# Altium schematic sheet EEM_Connectors_JTAG.SchDoc
size 420 x 297 mm; EDA_Number: ARTIQ; CompanyName: WUT ISE; Organization: WUT ISE; DocumentNumber: 5; SheetNumber: 11; Title2: EEM Connectors, JTAG switches; SPICEModelCacheVGBTAUBO: <root> / <DocumentId>VGBTAUBO</DocumentId> / <CacheFrame Number="0"> / <Model Name="pk14" Kind="CKT"> / <Text>*.INC dhvqfn.s / .SUBCKT pk14 / +    1   2   3   4   5   6   7   8   9  10 / +   11  12  13  14 / +   15  16  17  18  19  20  21  22  23  24 / +   25  26  27  28 / * Pin Resistance / r1 1 1001 9.078E-02 / r2 2 1002 8.829E-02 / r3 3 1003 8.731E-02 / r4 4 1004 8.710E-02 / r5 5 1005 8.731E-02 / r6 6 1006 8.829E-02 / r7 7 1007 9.075E-02 / r8 8 1008 9.072E-02 / r9 9 1009 8.809E-02 / r10 10 1010 8.716E-02 / r11 11 1011 8.706E-02 / r12 12 1012 8.720E-02 / r13 13 1013 8.816E-02 / r14 14 1014 9.068E-02 / * Pin Inductance / l1 1001 15 2.981E-09 / l2 1002 16 2.447E-09 / l3 1003 17 2.304E-09 / l4 1004 18 2.291E-09 / l5 1005 19 2.307E-09 / l6 1006 20 2.449E-09 / l7 1007 21 2.971E-09 / l8 1008 22 2.972E-09 / l9 1009 23 2.425E-09 / l10 1010 24 2.286E-09 / l11 1011 25 2.280E-09 / l12 1012 26 2.286E-09 / l13 1013 27 2.425E-09 / l14 1014 28 2.975E-09 / .ENDS pk14</Text> / </Model> / </CacheFrame> / </root>; ModifiedDate: -
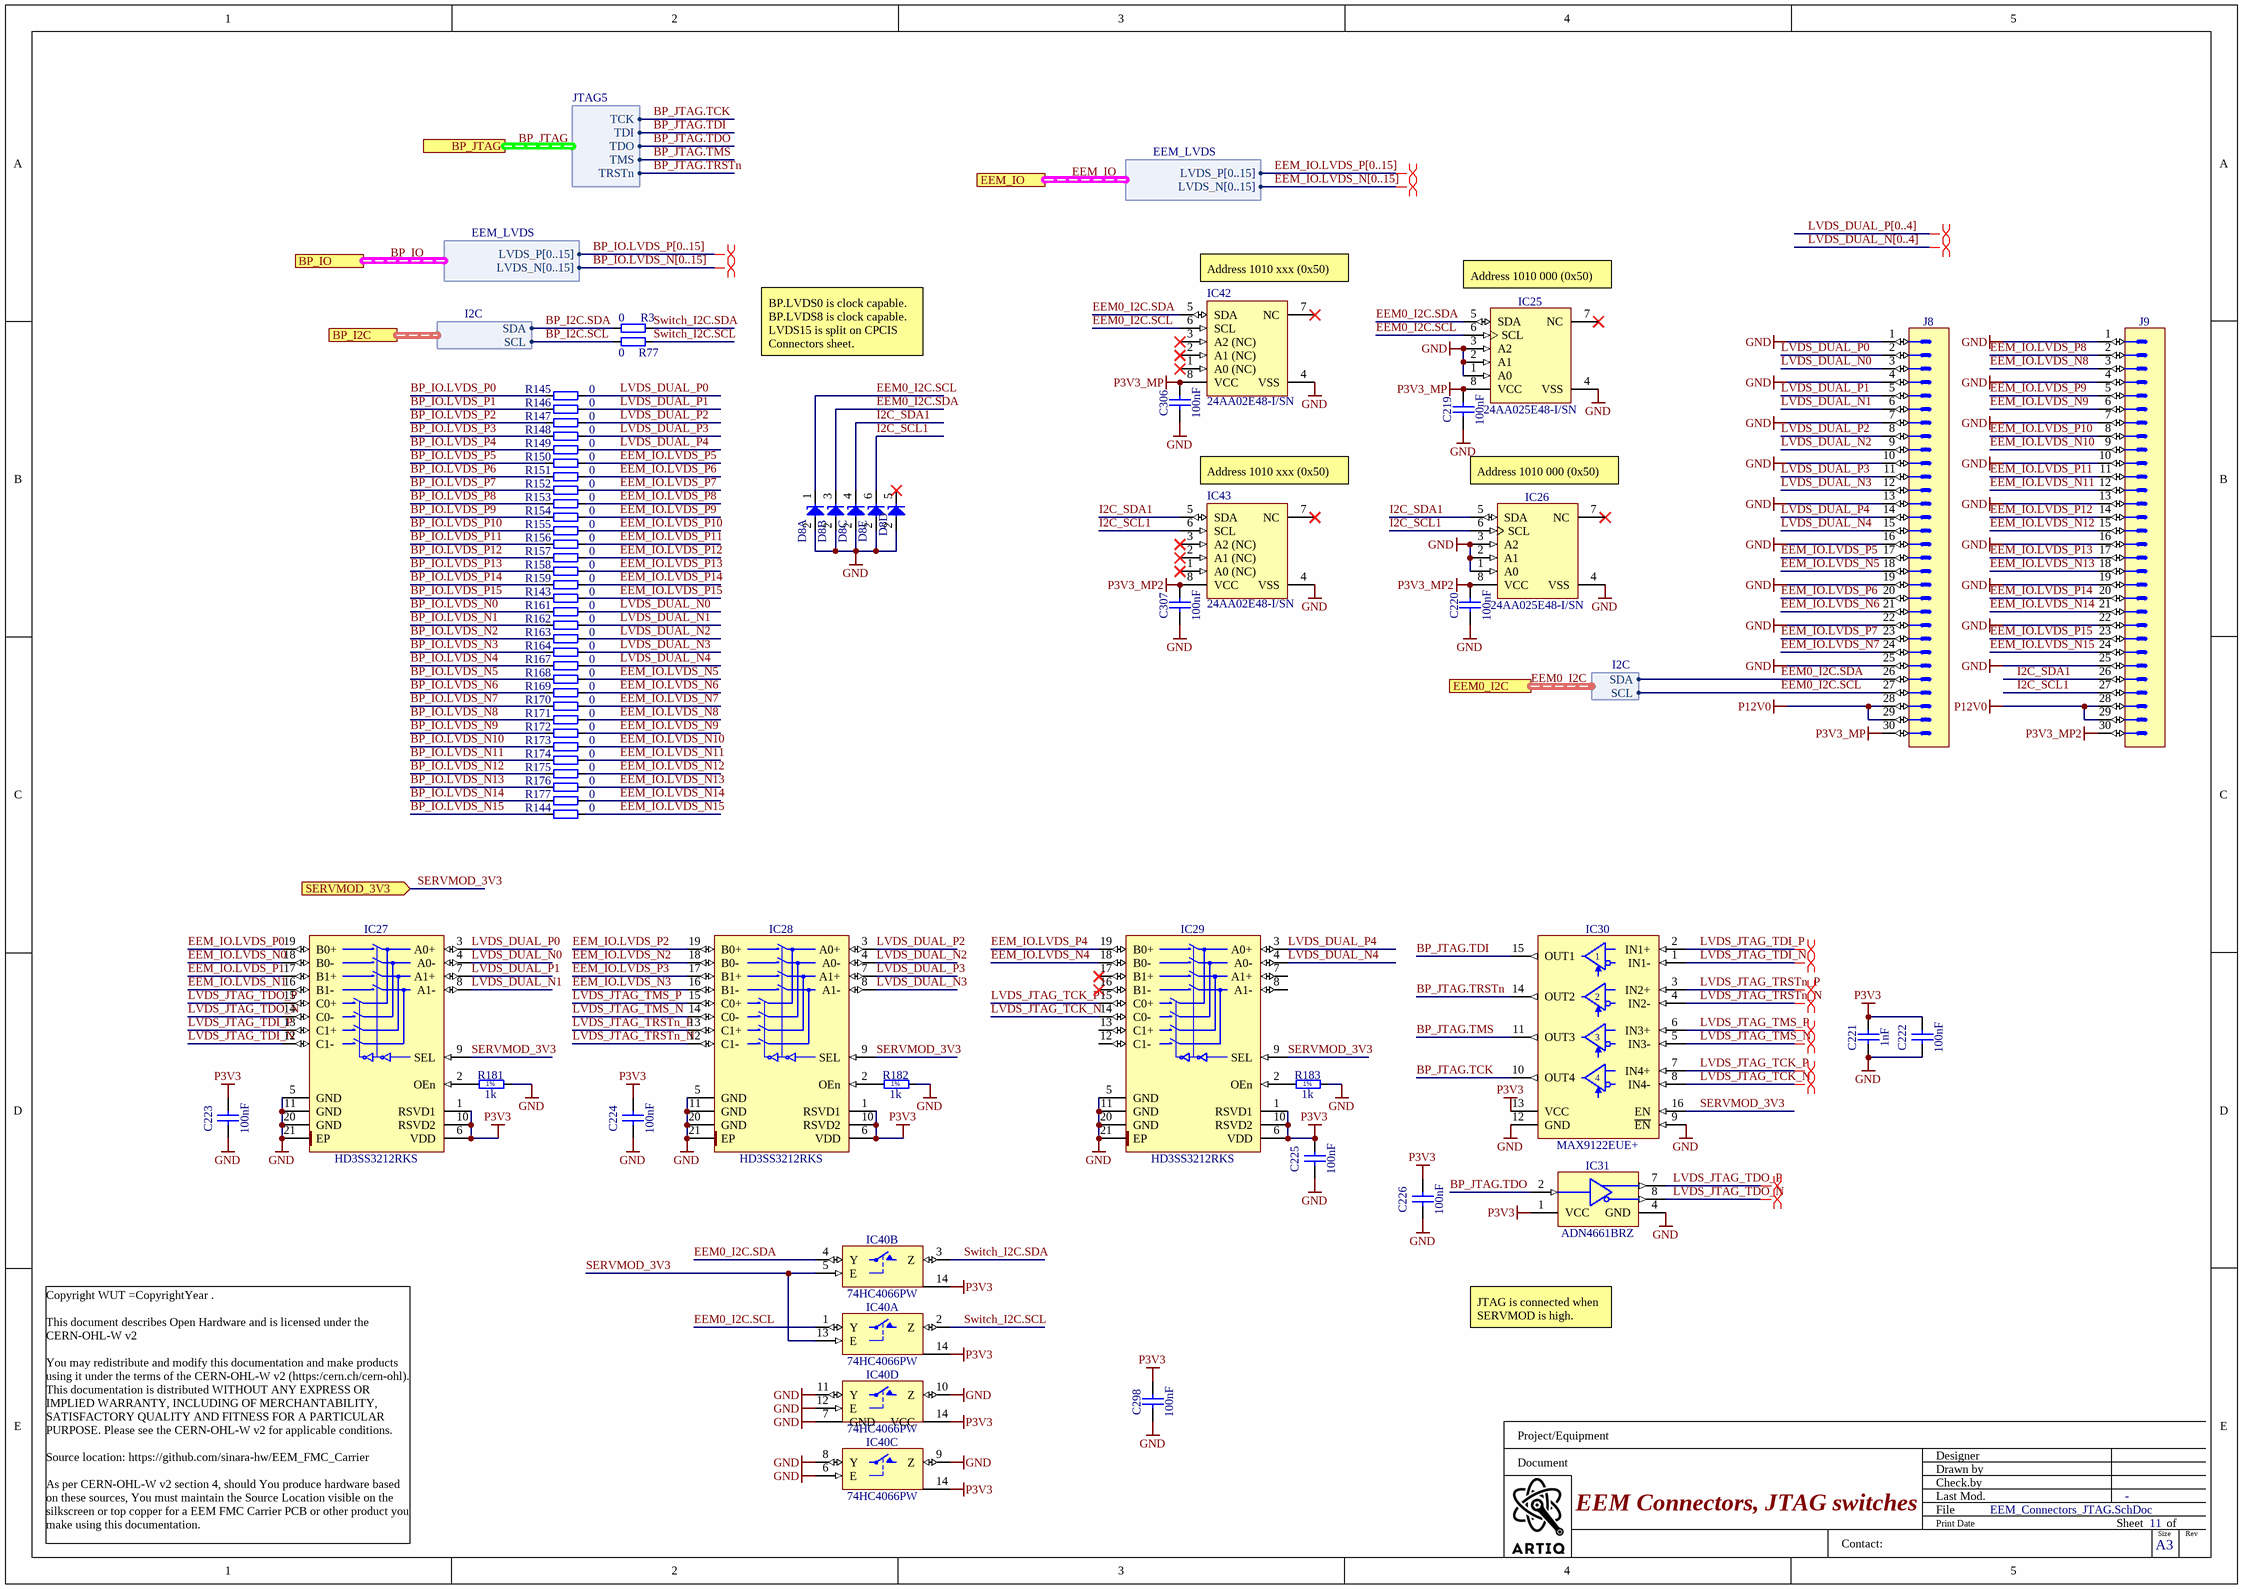
[diagram p0: EEM_Connectors_JTAG.SchDoc]

## Parts
C219  100nF  [CAPC1005X55N]
C220  100nF  [CAPC1005X55N]
C221  1nF  [CAPC1005X55N]
C222  100nF  [CAPC1005X55N]
C223  100nF  [CAPC1005X55N]
C224  100nF  [CAPC1005X55N]
C225  100nF  [CAPC1005X55N]
C226  100nF  [CAPC1005X55N]
C298  100nF  [CAPC1005X55N]
C306  100nF  [CAPC1005X55N]
C307  100nF  [CAPC1005X55N]
D8  PESD3V3L5UY  [SOT65P210X110-6N]  (value not drawn)  (parts A,B,C,D,E of 5)
IC25  24AA025E48-I/SN  [SOIC127P600X175-8N]
IC26  24AA025E48-I/SN  [SOIC127P600X175-8N]
IC27  HD3SS3212RKS  [TEXAS_RKS0020A]
IC28  HD3SS3212RKS  [TEXAS_RKS0020A]
IC29  HD3SS3212RKS  [TEXAS_RKS0020A]
IC30  MAX9122EUE+  [SOP65P640X110-16N]
IC31  ADN4661BRZ  [SOIC127P600X175-8N]
IC40  74HC4066PW  [SOP65P640X110-14N]  (parts A,B,C,D of 4)
IC42  24AA02E48-I/SN  [SOIC127]
IC43  24AA02E48-I/SN  [SOIC127]
J8  (no value)  [3M_N2530-6002RB]
J9  (no value)  [3M_N2530-6002RB]
R3  0  [RESC1005X40N]
R77  0  [RESC1005X40N]
R143  0  [RESC0603X28N]
R144  0  [RESC0603X28N]
R145  0  [RESC1005X40N]
R146  0  [RESC1005X40N]
R147  0  [RESC1005X40N]
R148  0  [RESC1005X40N]
R149  0  [RESC1005X40N]
R150  0  [RESC1005X40N]
R151  0  [RESC1005X40N]
R152  0  [RESC1005X40N]
R153  0  [RESC1005X40N]
R154  0  [RESC1005X40N]
R155  0  [RESC1005X40N]
R156  0  [RESC1005X40N]
R157  0  [RESC1005X40N]
R158  0  [RESC1005X40N]
R159  0  [RESC1005X40N]
R161  0  [RESC1005X40N]
R162  0  [RESC1005X40N]
R163  0  [RESC1005X40N]
R164  0  [RESC1005X40N]
R167  0  [RESC1005X40N]
R168  0  [RESC1005X40N]
R169  0  [RESC1005X40N]
R170  0  [RESC1005X40N]
R171  0  [RESC1005X40N]
R172  0  [RESC1005X40N]
R173  0  [RESC1005X40N]
R174  0  [RESC1005X40N]
R175  0  [RESC1005X40N]
R176  0  [RESC1005X40N]
R177  0  [RESC1005X40N]
R181  1k  [RESC1005X40N]
R182  1k  [RESC1005X40N]
R183  1k  [RESC1005X40N]

## Ports
BP_I2C (harness I2C), BP_IO (harness EEM_LVDS), BP_JTAG (harness JTAG5), EEM0_I2C (harness I2C), EEM_IO (harness EEM_LVDS), SERVMOD_3V3 (in)

## Harnesses
JTAG5: TCK, TDI, TDO, TMS, TRSTn
I2C: SDA, SCL
EEM_LVDS: LVDS_P[0..15], LVDS_N[0..15]

## Nets
GND: C219.1 C220.1 C221.1 C222.1 C223.1 C224.1 C225.1 C226.1 C298.1 C306.1 C307.1 D8.2(A) IC25.1(A0) IC25.2(A1) IC25.3(A2) IC25.4(VSS) IC26.1(A0) IC26.2(A1) IC26.3(A2) IC26.4(VSS) IC27.5(GND) IC27.11(GND) IC27.20(GND) IC27.21(EP) IC28.5(GND) IC28.11(GND) IC28.20(GND) IC28.21(EP) IC29.5(GND) IC29.11(GND) IC29.20(GND) IC29.21(EP) IC30.9(~{EN}) IC30.12(GND) IC31.4(GND) IC40.6(E) IC40.7(GND) IC40.8(Y) IC40.9(Z) IC40.10(Z) IC40.11(Y) IC40.12(E) IC42.4(VSS) IC43.4(VSS) J8.1 J8.4 J8.7 J8.10 J8.13 J8.16 J8.19 J8.22 J8.25 J9.1 J9.4 J9.7 J9.10 J9.13 J9.16 J9.19 J9.22 J9.25 R181.2 R182.2 R183.2
P3V3: C221.2 C222.2 C223.2 C224.2 C225.2 C226.2 C298.2 IC27.1(RSVD1) IC27.6(VDD) IC27.10(RSVD2) IC28.1(RSVD1) IC28.6(VDD) IC28.10(RSVD2) IC29.1(RSVD1) IC29.6(VDD) IC29.10(RSVD2) IC30.13(VCC) IC31.1(VCC) IC40.14(VCC)
P3V3_MP: C219.2 C306.2 IC25.8(VCC) IC42.8(VCC) J8.30
P3V3_MP2: C220.2 C307.2 IC26.8(VCC) IC43.8(VCC) J9.30
P12V0: J8.28 J8.29 J9.28 J9.29
BP_I2C.SCL: R77.1 ; port BP_I2C.SCL
BP_I2C.SDA: R3.1 ; port BP_I2C.SDA
BP_IO.LVDS_N0: R161.1
BP_IO.LVDS_N1: R162.1
BP_IO.LVDS_N2: R163.1
BP_IO.LVDS_N3: R164.1
BP_IO.LVDS_N4: R167.1
BP_IO.LVDS_N5: R168.1
BP_IO.LVDS_N6: R169.1
BP_IO.LVDS_N7: R170.1
BP_IO.LVDS_N8: R171.1
BP_IO.LVDS_N9: R172.1
BP_IO.LVDS_N10: R173.1
BP_IO.LVDS_N11: R174.1
BP_IO.LVDS_N12: R175.1
BP_IO.LVDS_N13: R176.1
BP_IO.LVDS_N14: R177.1
BP_IO.LVDS_N15: R144.2
BP_IO.LVDS_P0: R145.1
BP_IO.LVDS_P1: R146.1
BP_IO.LVDS_P2: R147.1
BP_IO.LVDS_P3: R148.1
BP_IO.LVDS_P4: R149.1
BP_IO.LVDS_P5: R150.1
BP_IO.LVDS_P6: R151.1
BP_IO.LVDS_P7: R152.1
BP_IO.LVDS_P8: R153.1
BP_IO.LVDS_P9: R154.1
BP_IO.LVDS_P10: R155.1
BP_IO.LVDS_P11: R156.1
BP_IO.LVDS_P12: R157.1
BP_IO.LVDS_P13: R158.1
BP_IO.LVDS_P14: R159.1
BP_IO.LVDS_P15: R143.2
BP_JTAG.TCK: IC30.10(OUT4) ; port BP_JTAG.TCK
BP_JTAG.TDI: IC30.15(OUT1) ; port BP_JTAG.TDI
BP_JTAG.TDO: IC31.2(DIN) ; port BP_JTAG.TDO
BP_JTAG.TMS: IC30.11(OUT3) ; port BP_JTAG.TMS
BP_JTAG.TRSTn: IC30.14(OUT2) ; port BP_JTAG.TRSTn
EEM0_I2C.SCL: D8.1(C) IC25.6(SCL) IC40.1(Y) IC42.6(SCL) J8.27 ; port EEM0_I2C.SCL
EEM0_I2C.SDA: D8.3(C) IC25.5(SDA) IC40.4(Y) IC42.5(SDA) J8.26 ; port EEM0_I2C.SDA
EEM_IO.LVDS_N0: IC27.18(B0-)
EEM_IO.LVDS_N1: IC27.16(B1-)
EEM_IO.LVDS_N2: IC28.18(B0-)
EEM_IO.LVDS_N3: IC28.16(B1-)
EEM_IO.LVDS_N4: IC29.18(B0-)
EEM_IO.LVDS_N5: J8.18 R168.2
EEM_IO.LVDS_N6: J8.21 R169.2
EEM_IO.LVDS_N7: J8.24 R170.2
EEM_IO.LVDS_N8: J9.3 R171.2
EEM_IO.LVDS_N9: J9.6 R172.2
EEM_IO.LVDS_N10: J9.9 R173.2
EEM_IO.LVDS_N11: J9.12 R174.2
EEM_IO.LVDS_N12: J9.15 R175.2
EEM_IO.LVDS_N13: J9.18 R176.2
EEM_IO.LVDS_N14: J9.21 R177.2
EEM_IO.LVDS_N15: J9.24 R144.1
EEM_IO.LVDS_P0: IC27.19(B0+)
EEM_IO.LVDS_P1: IC27.17(B1+)
EEM_IO.LVDS_P2: IC28.19(B0+)
EEM_IO.LVDS_P3: IC28.17(B1+)
EEM_IO.LVDS_P4: IC29.19(B0+)
EEM_IO.LVDS_P5: J8.17 R150.2
EEM_IO.LVDS_P6: J8.20 R151.2
EEM_IO.LVDS_P7: J8.23 R152.2
EEM_IO.LVDS_P8: J9.2 R153.2
EEM_IO.LVDS_P9: J9.5 R154.2
EEM_IO.LVDS_P10: J9.8 R155.2
EEM_IO.LVDS_P11: J9.11 R156.2
EEM_IO.LVDS_P12: J9.14 R157.2
EEM_IO.LVDS_P13: J9.17 R158.2
EEM_IO.LVDS_P14: J9.20 R159.2
EEM_IO.LVDS_P15: J9.23 R143.1
I2C_SCL1: D8.6(C) IC26.6(SCL) IC43.6(SCL) J9.27
I2C_SDA1: D8.4(C) IC26.5(SDA) IC43.5(SDA) J9.26
LVDS_DUAL_N0: IC27.4(A0-) J8.3 R161.2
LVDS_DUAL_N1: IC27.8(A1-) J8.6 R162.2
LVDS_DUAL_N2: IC28.4(A0-) J8.9 R163.2
LVDS_DUAL_N3: IC28.8(A1-) J8.12 R164.2
LVDS_DUAL_N4: IC29.4(A0-) J8.15 R167.2
LVDS_DUAL_P0: IC27.3(A0+) J8.2 R145.2
LVDS_DUAL_P1: IC27.7(A1+) J8.5 R146.2
LVDS_DUAL_P2: IC28.3(A0+) J8.8 R147.2
LVDS_DUAL_P3: IC28.7(A1+) J8.11 R148.2
LVDS_DUAL_P4: IC29.3(A0+) J8.14 R149.2
LVDS_JTAG_TCK_N: IC29.14(C0-) IC30.8(IN4-)
LVDS_JTAG_TCK_P: IC29.15(C0+) IC30.7(IN4+)
LVDS_JTAG_TDI_N: IC27.12(C1-) IC30.1(IN1-)
LVDS_JTAG_TDI_P: IC27.13(C1+) IC30.2(IN1+)
LVDS_JTAG_TDO_N: IC27.14(C0-) IC31.8(DOUT-)
LVDS_JTAG_TDO_P: IC27.15(C0+) IC31.7(DOUT+)
LVDS_JTAG_TMS_N: IC28.14(C0-) IC30.5(IN3-)
LVDS_JTAG_TMS_P: IC28.15(C0+) IC30.6(IN3+)
LVDS_JTAG_TRSTn_N: IC28.12(C1-) IC30.4(IN2-)
LVDS_JTAG_TRSTn_P: IC28.13(C1+) IC30.3(IN2+)
SERVMOD_3V3: IC27.9(SEL) IC28.9(SEL) IC29.9(SEL) IC30.16(EN) IC40.5(E) IC40.13(E) ; port SERVMOD_3V3
Switch_I2C.SCL: IC40.2(Z) R77.2
Switch_I2C.SDA: IC40.3(Z) R3.2
NetIC27_2: IC27.2(OEn) R181.1
NetIC28_2: IC28.2(OEn) R182.1
NetIC29_2: IC29.2(OEn) R183.1

Not connected (* = marked no-connect by the designer): D8 5(C)*; IC25 7(NC)*; IC26 7(NC)*; IC29 7(A1+) 8(A1-) 12(C1-) 13(C1+) 16(B1-)* 17(B1+)*; IC31 3(NC) 5(NC) 6(NC); IC42 1(A0_(NC))* 2(A1_(NC))* 3(A2_(NC))* 7(NC)*; IC43 1(A0_(NC))* 2(A1_(NC))* 3(A2_(NC))* 7(NC)*

## Buses and harness runs
bus BP_IO.LVDS_N[0..15]
bus BP_IO.LVDS_P[0..15]
bus EEM_IO.LVDS_N[0..15]
bus EEM_IO.LVDS_P[0..15]
bus LVDS_DUAL_N[0..4]
bus LVDS_DUAL_P[0..4]
harness BP_IO = port BP_IO
harness BP_JTAG = port BP_JTAG
harness EEM0_I2C = port EEM0_I2C
harness EEM_IO = port EEM_IO

## Layout directives
differential pair; differential pair class Diff_100Ohm: (no net found under the mark), LVDS_JTAG_TCK_N, LVDS_JTAG_TCK_P, LVDS_JTAG_TDI_N, LVDS_JTAG_TDI_P, LVDS_JTAG_TDO_N, LVDS_JTAG_TDO_P, LVDS_JTAG_TMS_N, LVDS_JTAG_TMS_P, LVDS_JTAG_TRSTn_N, LVDS_JTAG_TRSTn_P

## Notes on the sheet
- (near IC42) Address 1010 xxx (0x50)
- (near IC25) Address 1010 000 (0x50)
- BP.LVDS0 is clock capable.
  BP.LVDS8 is clock capable.
  LVDS15 is split on CPCIS Connectors sheet.
- Address 1010 xxx (0x50)
- Address 1010 000 (0x50)
- JTAG is connected when SERVMOD is high.
- Project/Equipment
- Document
- Designer
- Drawn by
- Check.by
- Copyright WUT =CopyrightYear .
  This document describes Open Hardware and is licensed under the CERN-OHL-W v2
  You may redistribute and modify this documentation and make products using it under the terms of the CERN-OHL-W v2 (https:/cern.ch/cern-ohl). This documentation is distributed WITHOUT ANY EXPRESS OR IMPLIED WARRANTY, INCLUDING OF MERCHANTABILITY, SATISFACTORY QUALITY AND FITNESS FOR A PARTICULAR PURPOSE. Please see the CERN-OHL-W v2 for applicable conditions.
  Source location: https://github.com/sinara-hw/EEM_FMC_Carrier
  As per CERN-OHL-W v2 section 4, should You produce hardware based on these sources, You must maintain the Source Location visible on the silkscreen or top copper for a EEM FMC Carrier PCB or other product you make using this documentation.
- Contact:
- File
- Last Mod.
- Print Date
- Sheet
- Size
- A3
- of
- Rev
- (in symbol R0402_1K_1%_0.0625W_100PPM) 1%

## Library data of the parts
C219 C222-C226 C306 C307 = CC0402_100NF_25V_10%_X7R_YUDEN_TMK105B7104KVHF: Non-polarised capacitor; Part Description: SMD Multilayer Chip Ceramic Capacitor (High Dielectric Type) for Automotive / Industrial Applications; Manufacturer: TAIYO YUDEN; Voltage: 25V; TC: X7R; Tolerance: ±10%; Part Number: CC0402_100NF_25V_10%_X7R_YUDEN_TMK105B7104KVHF; Component Kind: Standard; Component Type: Standard; Pin Count: 2; Value: 100nF; Status: Not Recommended; Manufacturer Part Number: TMK105B7104KVHF; Case: 0402; Mounted: Yes; Socket: No; SMD: Yes; Sense: No; HelpURL: \\cern.ch\dfs\Applications\Altium\Datasheets\CC0402_TAIYO-YUDEN_TMK105B7104KVHF.pdf; Author: CERN DEM JLC; CreateDate: 10-May-17; LatestRevisionDate: 10-May-17; ComponentHeight: 0.55mm
C220 C298 = CC0402_100NF_16V_10%_X5R: Non-polarised capacitor; Part Description: SMD Multilayer Chip Ceramic Capacitor; Manufacturer: GENERIC; Manufacturer1 Part Number: GRM155R61C104KA88D; Voltage: 16V; TC: X5R; Tolerance: ±10%; Part Number: CC0402_100NF_16V_10%_X5R; Component Kind: Standard; Component Type: Standard; Pin Count: 2; Value: 100nF; Status: None; Manufacturer Part Number: CC0402_100NF_16V_10%_X5R; Case: 0402; Mounted: Yes; Socket: No; SMD: Yes; Sense: No; Manufacturer1 Example: MURATA; Manufacturer1 ComponentHeight: 0.55mm; HelpURL: \\cern.ch\dfs\Applications\Altium\Datasheets\CC0402_X5R_MURATA_GRM.pdf; Author: CERN DEM JLC; CreateDate: 10.12.2013; LatestRevisionDate: 10.12.2013
C221 = CC0402_1NF_50V_10%_X7R: Non-polarised capacitor; Manufacturer: GENERIC; Part Description: SMD Multilayer Chip Ceramic Capacitor; Manufacturer1 Part Number: 223858715623; Tolerance: ±10%; Voltage: 50V; TC: X7R; Manufacturer Part Number: CC0402_1NF_50V_10%_X7R; Part Number: CC0402_1NF_50V_10%_X7R; Value: 1nF; Component Kind: Standard; Component Type: Standard; Pin Count: 2; Status: Not Recommended; Case: 0402; Mounted: Yes; Socket: No; SMD: Yes; Sense: No; Manufacturer1 Example: PHYCOMP; Manufacturer1 ComponentHeight: 0.55mm; HelpURL: \\cern.ch\dfs\Applications\Altium\Datasheets\CC0402_X7R_PHYCOMP.pdf; Author: CERN DEM JLC; CreateDate: 03.12.2007; LatestRevisionDate: 03.12.2007
D8 = PESD3V3L5UY: Fivefold ESD Protection Diode Arrays; Part Description: Fivefold ESD Protection Diode Arrays (30kV); Manufacturer: NEXPERIA; Voltage: 3.3V; Power: 200W; PressFit: No; Bonding: No; Part Number: PESD3V3L5UY; Component Kind: Standard; Component Type: Standard; Device: PESD3V3L5UY; PackageDescription: SOT363, SC-88, 0.65mm Pitch; 6 Pin, 1.25mm W X 2.00mm L X 1.10mm H body, IPC Medium Density; Manufacturer Part Number: PESD3V3L5UY; Pin Count: 6; Case: SOT363; Mounted: Yes; Socket: No; SMD: Yes; Sense: No; ComponentHeight: 1.1mm; HelpURL: \\cern.ch\dfs\Applications\Altium\Datasheets\PESD3V3L5UY.pdf; Author: CERN DEM WB; CreateDate: 05.07.2021; LatestRevisionDate: 05.07.2021
IC25 IC26 = 24AA025E48-I/SN: 1.7V-5.5V, 2K I2C™ Serial EEPROMs with EUI-48™ Node Identity; Manufacturer: MICROCHIP TECHNOLOGY; PressFit: No; Bonding: No; Part Number: 24AA025E48-I/SN; Component Kind: Standard; Component Type: Standard; Device: 24AA025E48-I/SN; PackageDescription: SOIC 8, Pitch 1.27mm - Body 4x5mm, IPC Medium Density; Part Description: 1.7V-5.5V, 2K I2C™ Serial EEPROMs with EUI-48™ Node Identity; Manufacturer Part Number: 24AA025E48-I/SN; Pin Count: 8; Case: SOIC8; Mounted: Yes; Socket: No; SMD: Yes; Sense: No; ComponentHeight: 1.75mm; HelpURL: \\cern.ch\dfs\Applications\Altium\Datasheets\24AA025E48-I-SN.pdf; Author: CERN DEM MR; CreateDate: 19.07.2016; LatestRevisionDate: 19.07.2016
IC27-IC29 = HD3SS3212RKS: Two-Channel Differential 2:1/1:2 USB3.1 Mux/Demux; Manufacturer: TEXAS INSTRUMENTS; PressFit: No; Bonding: No; Part Number: HD3SS3212RKS; Component Kind: Standard; Component Type: Standard; Device: HD3SS3212RKS; PackageDescription: QFN, TEXAS Case Style RKS, 0.50mm Pitch, Rect.; 20 Pin, 2.50mm L X 4.50mm W X 1.00mm H body (w/Thermal Tab 1.1mm X 3.1mm); Part Description: Two-Channel Differential 2:1/1:2 USB3.1 Mux/Demux; Manufacturer Part Number: HD3SS3212RKS; Pin Count: 21; Case: TQFN20; Mounted: Yes; Socket: No; SMD: Yes; Sense: No; ComponentHeight: 1mm; Author: CERN DEM BC; HelpURL: \\cern.ch\dfs\Applications\Altium\Datasheets\HD3SS3212RKS.pdf; CreateDate: 2019-11-06; LatestRevisionDate: 2019-11-06
IC30 = MAX9122EUE+: Quad LVDS Line Receivers with Integrated Termination and Flow-Through Pinout; Manufacturer: MAXIM; PressFit: No; Bonding: No; Part Number: MAX9122EUE+; Component Kind: Standard; Component Type: Standard; Device: MAX9122EUE+; PackageDescription: SOP, 0.65mm Pitch; 16 Pin, 4.40mm W X 5.00mm L X 1.10mm H body, IPC Medium Density; Part Description: Quad LVDS Line Receivers with Integrated Termination and Flow-Through Pinout; Manufacturer Part Number: MAX9122EUE+; Pin Count: 16; Case: TSSOP16; Mounted: Yes; Socket: No; SMD: Yes; Sense: No; ComponentHeight: 1.1mm; Author: CERN DEM MR; HelpURL: \\cern.ch\dfs\Applications\Altium\Datasheets\MAX9122EUE+.pdf; CreateDate: 2015-12-14; LatestRevisionDate: 2015-12-14
IC31 = ADN4661BRZ: Single, 3V, CMOS, LVDS, High Speed Differential Driver; Manufacturer: ANALOG DEVICES; PressFit: No; Bonding: No; Part Number: ADN4661BRZ; Component Kind: Standard; Component Type: Standard; Device: ADN4661BRZ; PackageDescription: SOIC 8, Pitch 1.27mm - Body 4x5mm, IPC Medium Density; Part Description: Single, 3V, CMOS, LVDS, High Speed Differential Driver; Manufacturer Part Number: ADN4661BRZ; Pin Count: 8; Case: SOIC8; Mounted: Yes; Socket: No; SMD: Yes; Sense: No; ComponentHeight: 1.75mm; Author: CERN DEM JMW; HelpURL: \\cern.ch\dfs\Applications\Altium\Datasheets\ADN4661BRZ.pdf; CreateDate: 2014-02-26; LatestRevisionDate: 2014-02-26
IC40 = 74HC4066PW: Part Description: Quad Single-Pole Single-Throw Analog Switch; Manufacturer: NXP SEMICONDUCTORS; PressFit: No; Bonding: No; Table: Standard Logic; Part Number: 74HC4066PW; Component Kind: Standard; Component Type: Standard; Device: 74HC4066PW; PackageDescription: SOP, 14-Leads, Body 4.4x5mm (max), Pitch 0.65mm, IPC Medium Density; Manufacturer Part Number: 74HC4066PW; Pin Count: 14; Case: TSSOP14; Mounted: Yes; Socket: No; SMD: Yes; ComponentHeight: 1.1mm; Author: CERN DEM JLC; HelpURL: \\cern.ch\dfs\Applications\Altium\Datasheets\74HC4066PW.pdf; CreateDate: 2014-11-19; LatestRevisionDate: 2014-11-19
IC42 IC43 = 24AA02E48-I/SN: 1.7V-5.5V, 2K I2C™ Serial EEPROMs with EUI-48™ Node Identity; Manufacturer Part Number: 24AA02E48-I/SN; Value: *
J8 J9 = 3M_N2530-6002RB: Connector 30 Male; Part Description: 30 Contacts - Straight .100'' x .100'' Low Profile Four-Wall Header, 2500 Series; Manufacturer: 3M; PressFit: No; Part Number: 3M_N2530-6002RB; Component Kind: Standard; Component Type: Standard; Pin Count: 30; Family: Header 30; Mounted: Yes; Socket: No; SMD: No; Sense: No; Status: None; Manufacturer Part Number: N2530-6002RB; ComponentHeight: 10.03mm; HelpURL: \\cern.ch\dfs\Applications\Altium\Datasheets\3M_N2530-6002RB.pdf; Author: CERN DEM JLC; CreateDate: 11.02.2009; LatestRevisionDate: 11.08.2009
R3 R77 R145-R159 R161-R164 R167-R177 = R0402_0R_JUMPER: Resistor; Part Description: 1A (0.05R Max DC Resistance) Zero Ohm Jumper; Manufacturer: GENERIC; Manufacturer1 Part Number: 232270591001L; PressFit: No; Part Number: R0402_0R_JUMPER; Component Kind: Standard; Component Type: Standard; Pin Count: 2; Value: 0; Status: Not Recommended; Manufacturer Part Number: R0402_0R_JUMPER; Case: 0402; Mounted: Yes; Sense: No; Socket: No; SMD: Yes; Manufacturer1 Example: YAGEO PHYCOMP; Manufacturer1 ComponentHeight: 0.4mm; HelpURL: \\cern.ch\dfs\Applications\Altium\Datasheets\R0402_Phycomp_RC0402.pdf; Author: CERN DEM JLC; CreateDate: 03.12.2007; LatestRevisionDate: 17.10.2012
R143 R144 = R0201_0R_JUMPER: Resistor; Part Description: 1A (0.05R Max DC Resistance) Zero Ohm Jumper; Manufacturer: GENERIC; Manufacturer1 Part Number: CRCW02010000Z0ED; PressFit: No; Part Number: R0201_0R_JUMPER; Component Kind: Standard; Component Type: Standard; Pin Count: 2; Value: 0; Status: Not Recommended; Manufacturer Part Number: R0201_0R_JUMPER; Case: 0201; Mounted: Yes; Sense: No; Socket: No; SMD: Yes; Manufacturer1 Example: VISHAY; Manufacturer1 ComponentHeight: 0.27mm; HelpURL: \\cern.ch\dfs\Applications\Altium\Datasheets\R0201_VISHAY_CRCW e3.pdf; Author: CERN DEM JLC; CreateDate: 2014-11-19; LatestRevisionDate: 2015-01-08
R181-R183 = R0402_1K_1%_0.0625W_100PPM: Resistor - 1%; Part Description: General Purpose Thick Film Chip Resistor; Manufacturer: GENERIC; Manufacturer1 Part Number: 232270671002L; TC: ±100ppm/°C; PressFit: No; Part Number: R0402_1K_1%_0.0625W_100PPM; Component Kind: Standard; Component Type: Standard; Pin Count: 2; Value: 1k; Status: Not Recommended; Power: 0.0625W; Tolerance: ±1%; Manufacturer Part Number: R0402_1K_1%_0.0625W_100PPM; Case: 0402; Mounted: Yes; Sense: No; Socket: No; SMD: Yes; Manufacturer1 Example: YAGEO PHYCOMP; Manufacturer1 ComponentHeight: 0.4mm; HelpURL: \\cern.ch\dfs\Applications\Altium\Datasheets\R0402_Phycomp_RC0402.pdf; Author: CERN DEM JLC; CreateDate: 2007-12-03; LatestRevisionDate: 2012-10-17